# EAGLE design IHM_BUTTONS (EAGLE 9.5.2)
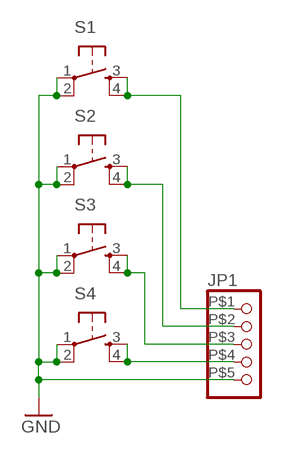
[diagram p0: schematic, sheet 1]

## Parts
JP1  PINHD-1X05_2.54-SMD-WIRE  [1X05WIRE]
S1  6MM_SWITCH6MM_SWITCH  [6MM_SWITCH]
S2  6MM_SWITCH6MM_SWITCH  [6MM_SWITCH]
S3  6MM_SWITCH6MM_SWITCH  [6MM_SWITCH]
S4  6MM_SWITCH6MM_SWITCH  [6MM_SWITCH]

## Nets
GND: JP1.P$5 S1.1(P) S1.2(P1) S2.1(P) S2.2(P1) S3.1(P) S3.2(P1) S4.1(P) S4.2(P1)
N$5: JP1.P$4 S4.3(S) S4.4(S1)
N$6: JP1.P$3 S3.3(S) S3.4(S1)
N$7: JP1.P$2 S2.3(S) S2.4(S1)
N$8: JP1.P$1 S1.3(S) S1.4(S1)

## Library data of the parts
JP1 = pinhead-2:PINHD-1X05: PIN HEADER
S1-S4 = fab:6MM_SWITCH: OMRON SWITCH

## Board
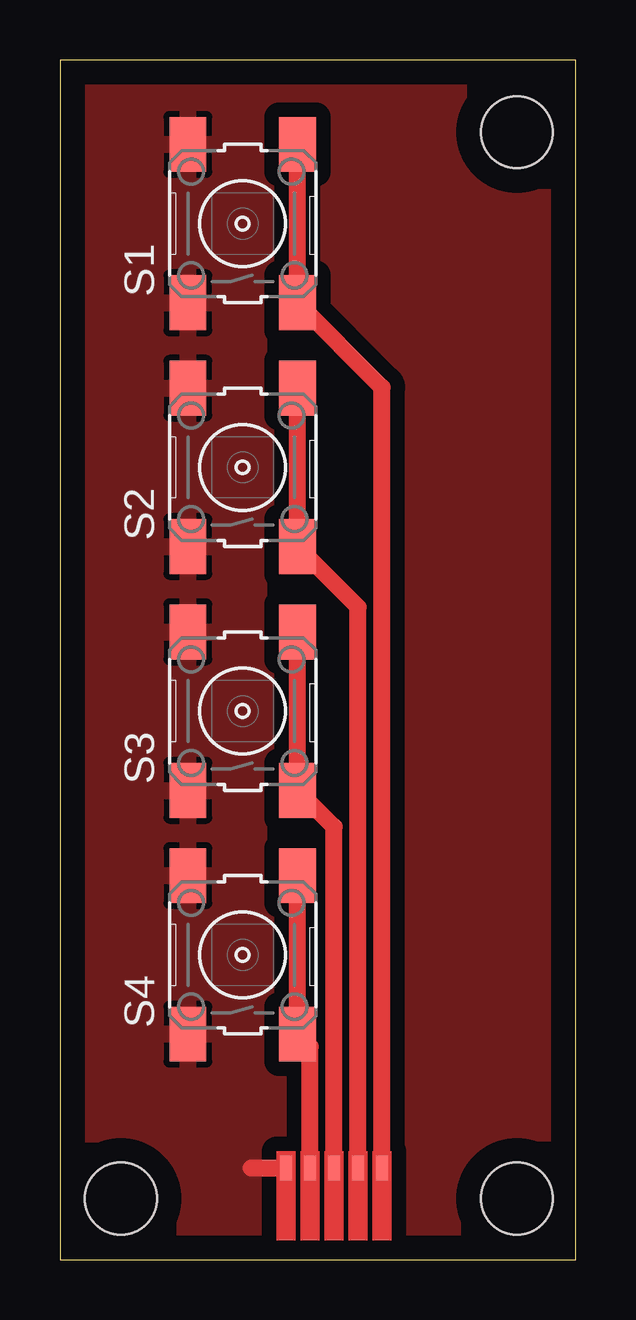
[diagram p1: board, top side]

Size 21.5 x 50 mm. Coordinates in mm from the lower left corner, seen from the top.
Outline: 0,0 21.5,0 21.5,50 0,50 0,0
Copper layers (1*16): Top 0.035mm / dielectric 1.5mm / Bottom 0.035mm
Design rules "default": minimum track width 6mil, minimum drill 0.35mm, track to track 6mil, track to pad 6mil, pad to pad 6mil, via to via 6mil, smd to smd 6mil, copper to edge 40mil, drill to drill 6mil, minimum pad ring 10mil, minimum via ring 8mil, stop-mask expansion 4mil, vias tented up to drill 0mil, thermal gap 10mil
Holes 3 mm at 2.54,2.54 19.05,2.54 19.05,46.99

### Footprints (pad centres in the part's own frame; a part is rotated, then mirrored left to right if it is on the bottom)
1X05WIRE = smd 0.508 x 1.016: P$1 -2,0; P$2 -1,0; P$3 0,0; P$4 1,0; P$5 2,0
6MM_SWITCH = smd 2.286 x 1.524: 1 -3.302,2.286; 2 3.302,2.286; 3 -3.302,-2.286; 4 3.302,-2.286

### Placement (x,y rotation side)
JP1  11.43,3.81 180 top
S1  7.62,43.18 90 top
S2  7.62,33.02 90 top
S3  7.62,22.86 90 top
S4  7.62,12.7 90 top

### Tracks (layer width: path | path; a pad name or v marks a point on that pad's centre or on a via)
GND
  Top 0.7: JP1.P$5 7.99,3.81
  pour Top (isolate 0.61): -3.81,52.07 24.13,52.07 24.13,-2.54 -3.81,-2.54
N$5
  Top 0.7: JP1.P$4 10.43,8.87 S4.3 S4.4
N$6
  Top 0.7: JP1.P$3 11.43,18.03 S3.3 S3.4
N$7
  Top 0.7: JP1.P$2 12.43,27.19 S2.3 S2.4
N$8
  Top 0.7: JP1.P$1 13.43,36.35 S1.3 S1.4